# Altium schematic sheet Sensors + CAN.SchDoc: Sensors and CAN
size A4; Organization: Use Organization_Name in ProjParam; Address1: Eliot Ferragni; Address2: STI-MOBOTS; Address3: EPFL; Address4: CH-1015 LAUSANNE; DocumentNumber: 9; Revision: A; SheetNumber: 9; SheetTotal: 11; ApprovedBy: Init ApprovedBy in DocParam; CheckedBy: Init CheckedBy in DocParam; Author: Init Author in DocParam; CompanyName: Init CompanyName in DocParam; DrawnBy: Init DrawBy in DocParam; Engineer: Init Engineer in DocParam; Title2: IMU, dist., press. sensors, 4 Mics, CAN trans., IR rec.; DocumentName: Init DocumentName in DocParam; ProjectName: Init ProjectName in DocParam
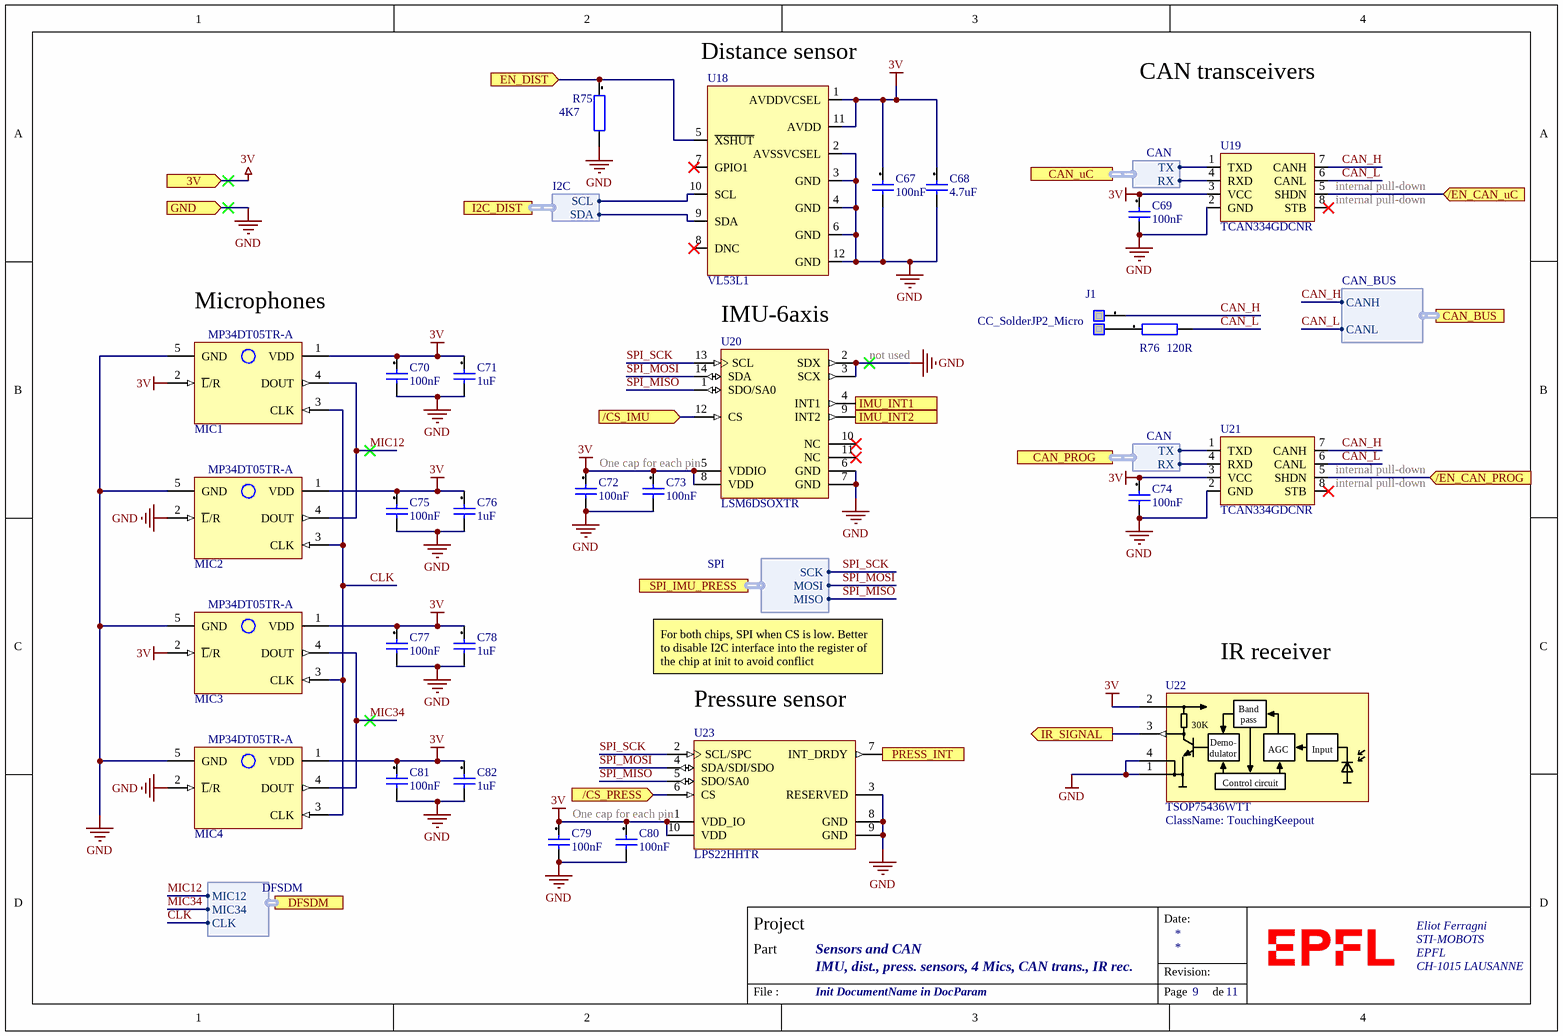
[diagram p0: Sensors + CAN.SchDoc]

## Parts
C67  100nF  [CAPC0201(0603)33_L]
C68  4.7uF  [CAPC0201(0603)33_L]
C69  100nF  [CAPC0201(0603)33_L]
C70  100nF  [CAPC0201(0603)33_L]
C71  1uF  [CAPC0201(0603)33_L]
C72  100nF  [CAPC0201(0603)33_L]
C73  100nF  [CAPC0201(0603)33_L]
C74  100nF  [CAPC0201(0603)33_L]
C75  100nF  [CAPC0201(0603)33_L]
C76  1uF  [CAPC0201(0603)33_L]
C77  100nF  [CAPC0201(0603)33_L]
C78  1uF  [CAPC0201(0603)33_L]
C79  100nF  [CAPC0201(0603)33_L]
C80  100nF  [CAPC0201(0603)33_L]
C81  100nF  [CAPC0201(0603)33_L]
C82  1uF  [CAPC0201(0603)33_L]
J1  CC_SolderJP2_Micro  [CC_SolderJP_U]  (no BOM)
MIC1  MP34DT05TR-A  [MIC-PACK_MP34DT05-A(Primary)]
MIC2  MP34DT05TR-A  [MIC-PACK_MP34DT05-A(Primary)]
MIC3  MP34DT05TR-A  [MIC-PACK_MP34DT05-A(Primary)]
MIC4  MP34DT05TR-A  [MIC-PACK_MP34DT05-A(Primary)]
R75  4K7  [RESC0201(0603)_L]
R76  120R  [RESC0201(0603)_L]
U18  VL53L1  [VL53L1x]
U19  TCAN334GDCNR  [SOT-23-8]
U20  LSM6DSOXTR  [STM_LGA_14L]
U21  TCAN334GDCNR  [SOT-23-8]
U22  TSOP75436WTT  ClassName: TouchingKeepout  [VISHAY-TSOP752-754]
U23  LPS22HHTR  [STM_HLGA_10L]

## Ports
3V (in), /CS_IMU (in), /CS_PRESS (in), /EN_CAN_PROG (in), /EN_CAN_uC (in), CAN_BUS (harness CAN_BUS), CAN_PROG (harness CAN), CAN_uC (harness CAN), DFSDM (harness DFSDM), EN_DIST (in), GND (in), I2C_DIST (harness I2C), IMU_INT1 (out), IMU_INT2 (out), IR_SIGNAL (out), PRESS_INT (out), SPI_IMU_PRESS (harness SPI)

## Harnesses
SPI: MISO, MOSI, SCK
CAN: TX, RX
CAN_BUS: CANH, CANL
DFSDM: MIC34, MIC12, CLK
I2C: SDA, SCL

## Nets
3V: C67.1 C68.1 C69.1 C70.1 C71.1 C72.1 C73.1 C74.1 C75.1 C76.1 C77.1 C78.1 C79.1 C80.1 C81.1 C82.1 MIC1.1(VDD) MIC1.2(~{L}/R) MIC2.1(VDD) MIC3.1(VDD) MIC3.2(~{L}/R) MIC4.1(VDD) U18.1(AVDDVCSEL) U18.11(AVDD) U19.3(VCC) U20.5(VDDIO) U20.8(VDD) U21.3(VCC) U22.2(VS) U23.1(VDD_IO) U23.10(VDD) ; port 3V
GND: C67.2 C68.2 C69.2 C70.2 C71.2 C72.2 C73.2 C74.2 C75.2 C76.2 C77.2 C78.2 C79.2 C80.2 C81.2 C82.2 MIC1.5(GND) MIC2.2(~{L}/R) MIC2.5(GND) MIC3.5(GND) MIC4.2(~{L}/R) MIC4.5(GND) R75.2 U18.2(AVSSVCSEL) U18.3(GND) U18.4(GND) U18.6(GND) U18.12(GND) U19.2(GND) U20.2(SDX) U20.3(SCX) U20.6(GND) U20.7(GND) U21.2(GND) U22.1(GND) U22.4(GND) U23.3(RESERVED) U23.8(GND) U23.9(GND) ; port GND
/CS_IMU: U20.12(CS) ; port /CS_IMU
/CS_PRESS: U23.6(CS) ; port /CS_PRESS
/EN_CAN_PROG: U21.5(SHDN) ; port /EN_CAN_PROG
/EN_CAN_uC: U19.5(SHDN) ; port /EN_CAN_uC
CAN_H: J1.1 U19.7(CANH) U21.7(CANH) ; port CAN_BUS.CANH
CAN_L: R76.2 U19.6(CANL) U21.6(CANL) ; port CAN_BUS.CANL
CLK: MIC1.3(CLK) MIC2.3(CLK) MIC3.3(CLK) MIC4.3(CLK) ; port DFSDM.CLK
EN_DIST: R75.1 U18.5(~{XSHUT}) ; port EN_DIST
IMU_INT1: U20.4(INT1) ; port IMU_INT1
IMU_INT2: U20.9(INT2) ; port IMU_INT2
IR_SIGNAL: U22.3(OUT) ; port IR_SIGNAL
MIC12: MIC1.4(DOUT) MIC2.4(DOUT) ; port DFSDM.MIC12
MIC34: MIC3.4(DOUT) MIC4.4(DOUT) ; port DFSDM.MIC34
PRESS_INT: U23.7(INT_DRDY) ; port PRESS_INT
SPI_MISO: U20.1(SDO/SA0) U23.5(SDO/SA0) ; port SPI_IMU_PRESS.MISO
SPI_MOSI: U20.14(SDA) U23.4(SDA/SDI/SDO) ; port SPI_IMU_PRESS.MOSI
SPI_SCK: U20.13(SCL) U23.2(SCL/SPC) ; port SPI_IMU_PRESS.SCK
NetJ1_2: J1.2 R76.1
NetU18_9: U18.9(SDA) ; port I2C_DIST.SDA
NetU18_10: U18.10(SCL) ; port I2C_DIST.SCL
NetU19_1: U19.1(TXD) ; port CAN_uC.TX
NetU19_4: U19.4(RXD) ; port CAN_uC.RX
NetU21_1: U21.1(TXD) ; port CAN_PROG.TX
NetU21_4: U21.4(RXD) ; port CAN_PROG.RX

Not connected (* = marked no-connect by the designer): U18 7(GPIO1)* 8(DNC)*; U19 8(STB)*; U20 10(NC)* 11(NC)*; U21 8(STB)*

## Notes on the sheet
- (near U18) Distance sensor
- CAN transceivers
- (near U19) internal pull-down
- (near MIC1) Microphones
- IMU-6axis
- (near U20) not used
- (near U20) One cap for each pin
- (near U21) internal pull-down
- For both chips, SPI when CS is low. Better to disable I2C interface into the register of the chip at init to avoid conflict
- (near U23) Pressure sensor
- IR receiver
- (near U23) One cap for each pin
- Date:
- Project
- Part
- Revision:
- File :
- Page
- de
- (in symbol TSOP75436WTT[[/\]]1) 30K; Band / pass; AGC; Input; Demo- / dulator; Control circuit

## Library data of the parts
C67-C82 = TBD Capacitor[[/\]]0201[[/\]]1: Capacitor 0201; Preference: 1; Currentie: CHF; Type: SMD; Note: To buy by assembler; Size: 0201; Footprint Acort: 0201; ROHS: True; DateLastUpdate: 2018-10-19 / 8:59:52 AM; Manufacturer: -; Manufacturer part number: -; Package / Case: Capacitor 0201
J1 = CC_SolderJP2_Micro: Micro Solder Jumper 2 leads; Preference: 1; Footprint Acort: ToDefine; DateLastUpdate: 2008-02-26 / 09:57:0; Type: SMD
MIC1-MIC4 = MP34DT05TR-A: MEMS AUD MIC SENSOR OMNI 4HCLGA; Manufacturer: STMicroelectronics; Output Type: Digital, PDM; Direction: Omnidirectional; Sensitivity: -26dB ±3dB @ 94dB SPL; S/N Ratio: 64dB; Port Location: Top; Shape: Rectangular; Note: To buy by assembler; Supplier 1: Digi-Key; Manufacturer Part Number: MP34DT05TR-A; RoHS: Request Inventory Verification; Category: Audio Products; Stock 1: 3088; Pricing 1: 1=1.41, 10=1.117, 100=0.8855, 500=0.7535, 1000=0.704 (USD); Packaging: Cut Tape (CT); Part Status: Active; Type: SMD; Ratings: -; Termination: Solder Pads; Height (Max): 0.043" (1.10mm); ComponentLink1URL: http://www.st.com/content/ccc/resource/technical/document/datasheet/group3/c7/90/d3/f6/b7/e7/40/c8/DM00415595/files/DM00415595.pdf/jcr:content/translations/en.DM00415595.pdf; ComponentLink1Description: http://www.st.com/content/ccc/resource/technical/document/datasheet/group3/c7/90/d3/f6/b7/e7/40/c8/DM00415595/files/DM00415595.pdf/jcr:content/translations/en.DM00415595.pdf; Supplier Part Number 1: 497-17809-1-ND; Package / Case: HCLGA-4LD
R75 R76 = TBD[[/\]]0201[[/\]]1: Resistor 0201; Preference: 1; Currentie: CHF; Note: To buy by assembler; Size: 0201; Footprint Acort: 0201; ROHS: True; DateLastUpdate: 2018-10-19 / 9:06:49 AM; Type: SMD; Manufacturer: -; Manufacturer part number: -; Package / Case: Resistor 0201
U18 = VL53L1CXV0FY/1_1: Time-of-Flight sensor, 4 - 400 cm distance, OPTICAL LGA12 4.9 x 2.5 x 1.56 mm, 940 nm laser (Class 1); Manufacturer: STMicroelectronics; Sensing Distance: 157.480" (4m); Output Type: I²C; Voltage - Supply: 2.6 V ~ 3.5 V; Note: To buy by assembler; Supplier 1: Digi-Key; Manufacturer Part Number: VL53L1CXV0FY/1; RoHS: Request Inventory Verification; Category: Sensors, Transducers; Stock 1: 12283; Pricing 1: 1=6.62, 10=5.979, 100=4.9502 (USD); Part Status: Active; Voltage - Output Difference (Typ) @ Distance: -; Voltage - Output (Typ) @ Distance: -; Operating Temperature: -20°C ~ 85°C (TA); Base Part Number: VL53L1X; ComponentLink1URL: http://www.st.com/content/ccc/resource/technical/document/datasheet/group3/7d/85/c8/95/fb/3b/4e/2d/DM00452094/files/DM00452094.pdf/jcr:content/translations/en.DM00452094.pdf; ComponentLink1Description: http://www.st.com/content/ccc/resource/technical/document/datasheet/group3/7d/85/c8/95/fb/3b/4e/2d/DM00452094/files/DM00452094.pdf/jcr:content/translations/en.DM00452094.pdf; Supplier Part Number 1: 497-17764-1-ND; Type: SMD; Package / Case: Optical LGA12
U19 U21 = TCAN334GDCNR: IC TXRX CAN 3.3V SOT23-8; Manufacturer: Texas Instruments; Note: To buy by assembler; Supplier 1: Digi-Key; Stock 1: 2700; Pricing 1: 1 = 2,76000, 10 = 2,48100, 100 = 2,03260, 500 = 1,73032, 1000 = 1,45930 (USD); RoHS: No; Min Operating Temperature: -40°C; Max Operating Temperature: 125°C; Lead Free: Lead Free; ComponentLink1URL: http://www.ti.com/lit/ds/symlink/tcan334.pdf?src-supplier=Digi-Key; ComponentLink1Description: http://www.ti.com/lit/ds/symlink/tcan334.pdf?src-supplier=Digi-Key; Supplier Part Number 1: 296-49939-1-ND; Manufacturer Part Number: TCAN334GDCNR; Type: SMD; Package / Case: SOT-23-8
U20 = LSM6DSOXTR: IMU 6-AXIS; Manufacturer: STMicroelectronics; Note: To buy by assembler; Supplier 1: Digi-Key; Stock 1: 2573; Pricing 1: 1 = 4,91000, 10 = 4,41300, 100 = 3,61530, 500 = 3,07764, 1000 = 2,59560 (USD); RoHS: No; Supplier Part Number 1: 497-18367-1-ND; Manufacturer Part Number: LSM6DSOXTR; Type: SMD; Package / Case: STM_LGA_14L
U22 = TSOP75436WTT[[/\]]1: Vishay 	TSOP75436WTT IR Receiver Modules for Remote Control Systems; Preference: 1; Quant_2: 50; Quant_3: 200; Currentie: CHF; Note: To buy by assembler; Size: TSOP752-754; Footprint Acort: ToDefine; ComponentLink1URL: http://www.vishay.com/docs/82496/tsop752w.pdf; ComponentLink1Description: Datasheet; Supplier: Farnell; Supplier Nr: 2251419; ComponentLink2Description: Farnell link; ComponentLink2URL: http://ch.farnell.com/fr-CH/vishay/tsop75436wtt/recepteur-ir-heimdall-agc4-36khz/dp/2251419; Manufacturer: Vishay; Manufacturer Nr: TSOP75436WTT; Quant_1: 1; Price_1: 1.144; Price_2: 1.056; Price_3: 0.924; ROHS: True; DateLastUpdate: 2014-11-27 / 08:18:45; Type: SMD; Manufacturer part number: TSOP75436WTT; Package / Case: SMD module
U23 = LPS22HHTR: Pressure Sensor; Manufacturer: STMicroelectronics; Note: To buy by assembler; Supplier 1: Digi-Key; Stock 1: 8271; Pricing 1: 1 = 3,50000, 10 = 3,14200, 100 = 2,57400, 500 = 2,19120, 1000 = 1,84800 (USD); RoHS: No; ComponentLink1URL: https://www.st.com/resource/en/datasheet/lps22hh.pdf?src-supplier=Digi-Key; ComponentLink1Description: https://www.st.com/resource/en/datasheet/lps22hh.pdf?src-supplier=Digi-Key; ComponentLink2URL: https://www.st.com/resource/en/data_brief/lps22hh.pdf?src-supplier=Digi-Key; ComponentLink2Description: https://www.st.com/resource/en/data_brief/lps22hh.pdf?src-supplier=Digi-Key; Supplier Part Number 1: 497-18182-1-ND; Manufacturer Part Number: LPS22HHTR; Type: SMD; Package / Case: STM_HLGA_10L